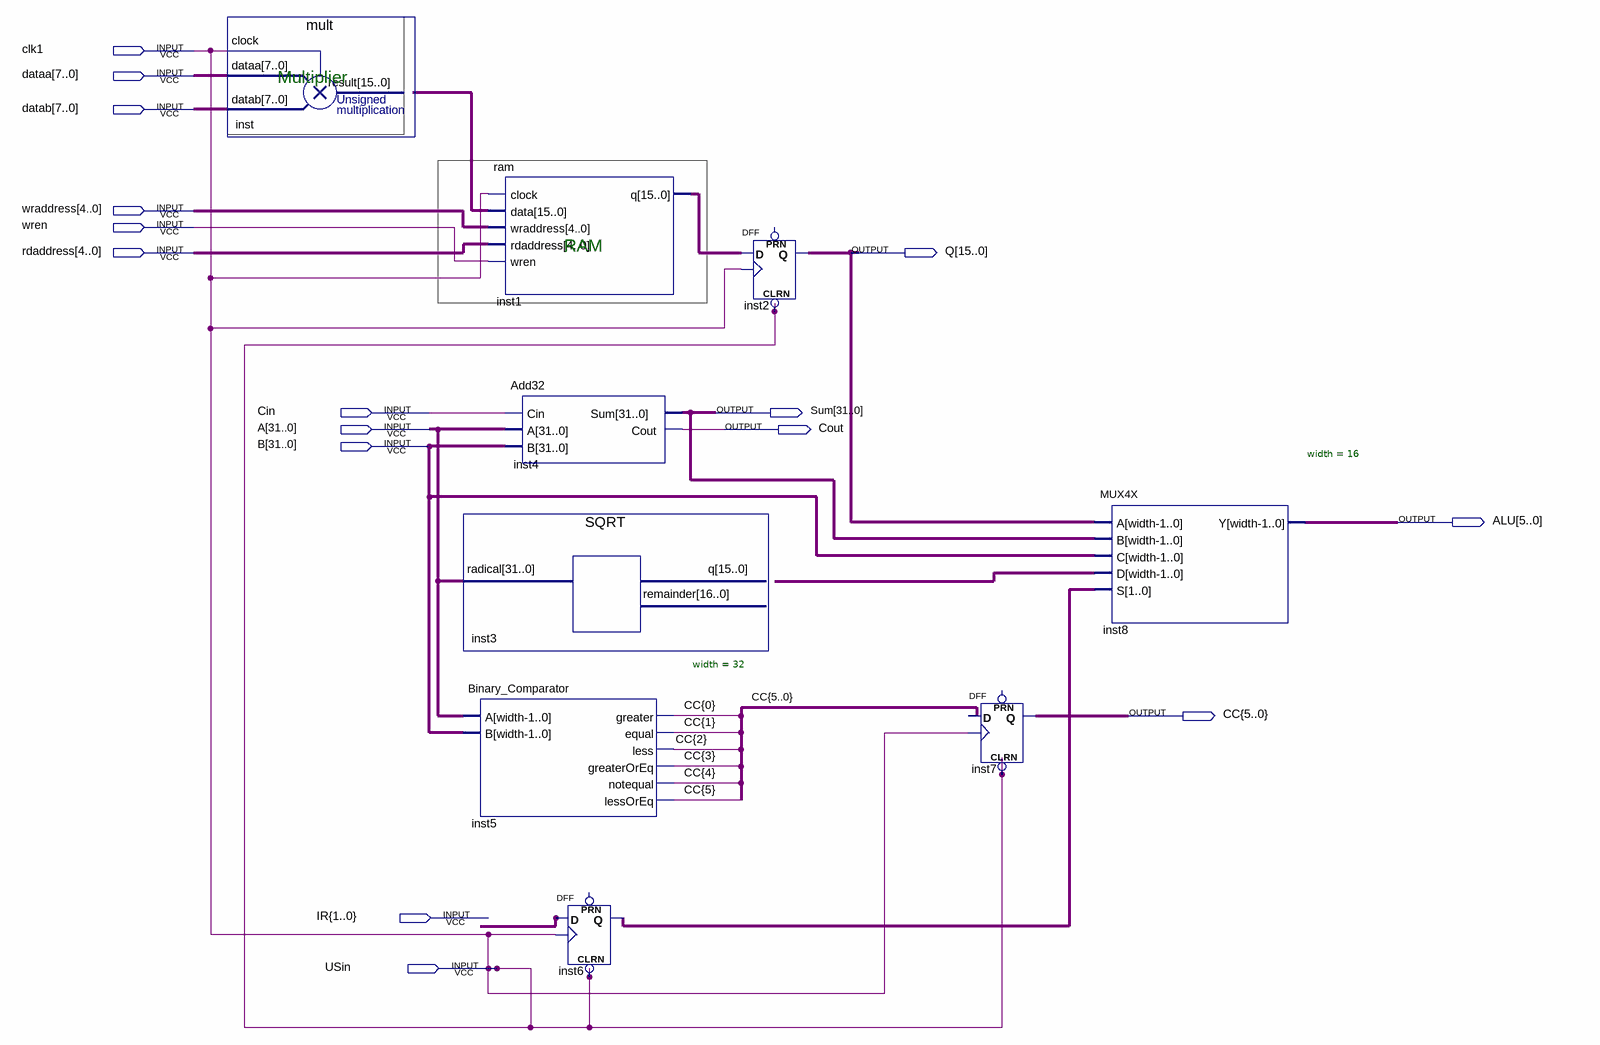
[diagram p0: schematic sheet]
// Quartus schematic pipemult.bdf as structural Verilog: 9 symbols, 16 pins
module pipemult (
  input  clk1,
  input  [7:0] dataa,
  input  [7:0] datab,
  input  [4:0] wraddress,
  input  wren,
  input  [4:0] rdaddress,
  input  Cin,
  input  [31:0] A,
  input  [31:0] B,
  input  \IR{1..0} ,
  input  USin,
  output [15:0] Q,
  output [31:0] Sum,
  output Cout,
  output [5:0] ALU,
  output \CC{5..0} 
);

  wire \CC{0} , \CC{1} , \CC{2} , \CC{3} , \CC{4} , \CC{5} ;
  wire [1:0] inst6_q, undriven;
  wire [15:0] inst1_q, inst_result, undriven_2;

  mult inst (.clock(clk1), .dataa(dataa), .datab(datab), .result(inst_result));
  ram inst1 (.clock(clk1), .data(inst_result), .wraddress(wraddress), .rdaddress(rdaddress), .wren(wren), .q(inst1_q));
  SQRT inst3 (.radical(A));  // open: q, remainder
  Binary_Comparator #(.width(32)) inst5 (
    .A(A), .B(B), .greater(\CC{0} ), .equal(\CC{1} ), .less(\CC{2} ), .greaterOrEq(\CC{3} ),
    .notequal(\CC{4} ), .lessOrEq(\CC{5} ));
  Add32 inst4 (.Cin(Cin), .A(A), .B(B), .Sum(Sum), .Cout(Cout));
  DFF inst6[1:0] (.CLRN(clk1), .CLK(clk1), .D(undriven), .Q(inst6_q));  // open: PRN
  DFF inst2[15:0] (.CLRN(clk1), .CLK(clk1), .D(inst1_q), .Q(Q));  // open: PRN
  DFF inst7 (.CLRN(clk1), .CLK(clk1), .D(\CC{5..0} ), .Q(\CC{5..0} ));  // open: PRN
  MUX4X #(.width(16)) inst8 (.A(Q), .B(Sum), .C(B), .D(undriven_2), .S(inst6_q), .Y(ALU));

  assign USin = clk1;

  // Notes on the sheet:
  //   Multiplier
  //   RAM
endmodule
